# EAGLE design avr modem (EAGLE 6.4)
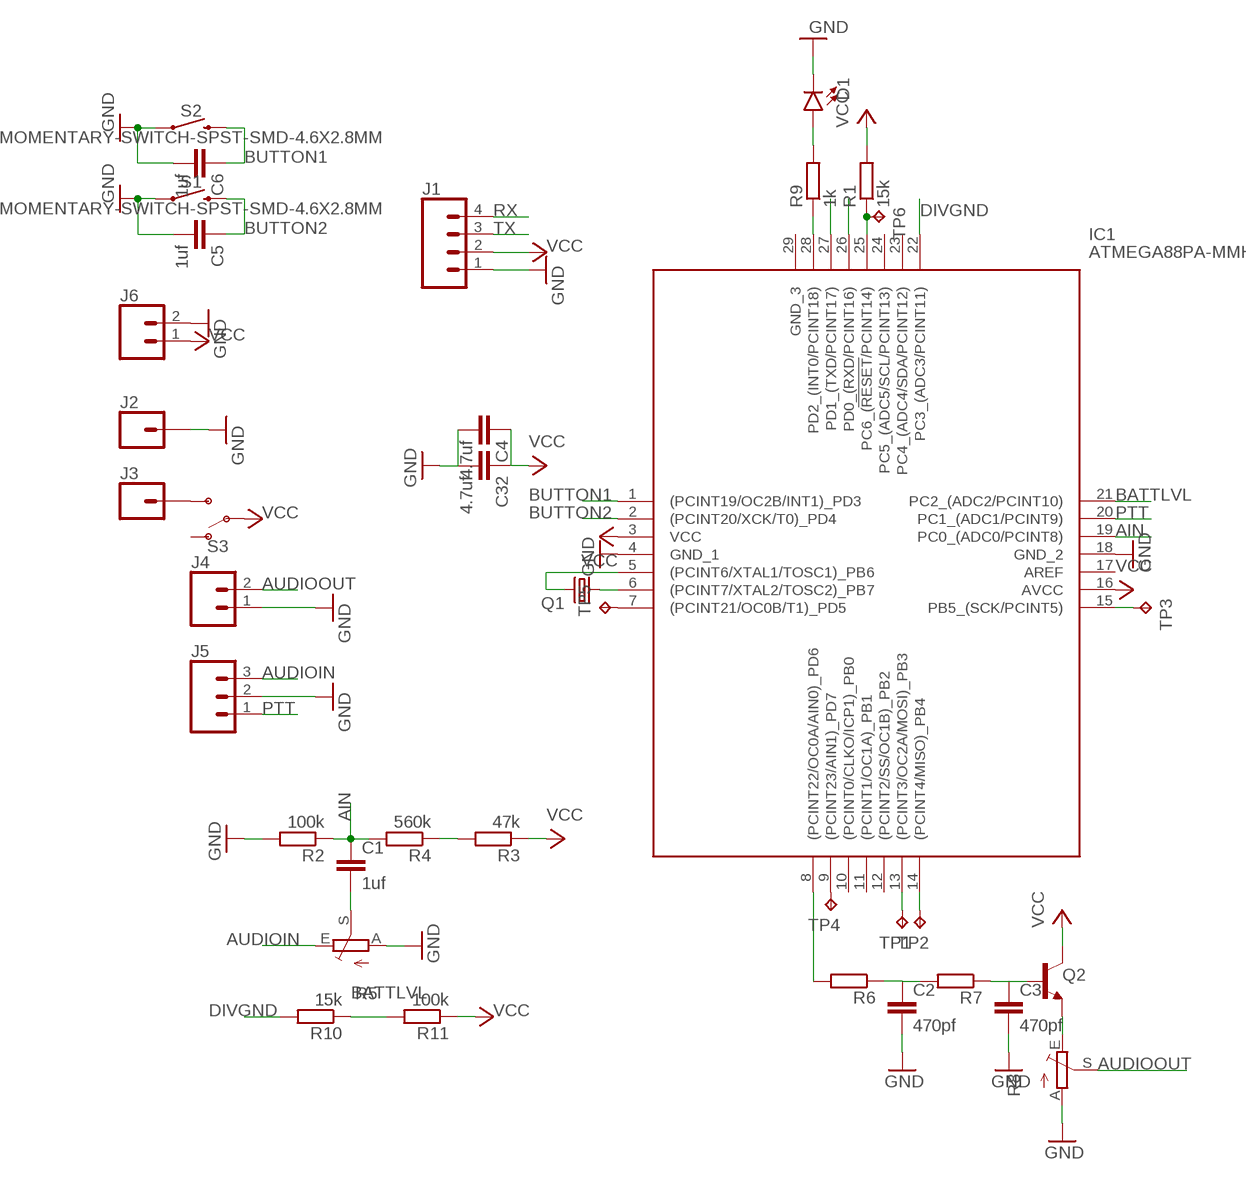
[diagram p0: schematic, sheet 1]

## Parts
C1  1uf  C-EUC0805  [C0805]
C2  470pf  C-EUC0805  [C0805]
C3  470pf  C-EUC0805  [C0805]
C4  4.7uf  C-EUC0805  [C0805]
C5  1uf  C-EUC0805  [C0805]
C6  1uf  C-EUC0805  [C0805]
C32  4.7uf  C-EUC0805  [C0805]
D1  LED0603  [LED-0603]
IC1  ATMEGA88PA-MMH  [QFN45P400X400X100-29N]
J1  CONN_04LONGPADS  [1X04_LONGPADS]
J2  CONN_01PTH_LONGPAD  [1X01_LONGPAD]
J3  CONN_01PTH_LONGPAD  [1X01_LONGPAD]
J4  CONN_02PTH3  [1X02_LONGPADS]
J5  CONN_03LONGPADS  [1X03_LONGPADS]
J6  CONN_02PTH3  [1X02_LONGPADS]
Q1  CRYSTALCTS406  [CTS406]
Q2  TRANS_NPN-MMBTA42  [SOT23-3]
R1  15k  R-EU_M0805  [M0805]
R2  100k  R-EU_M0805  [M0805]
R3  47k  R-EU_M0805  [M0805]
R4  560k  R-EU_M0805  [M0805]
R5  TRIM_EU-CA6V  [CA6V]
R6  R-EU_M0805  [M0805]
R7  R-EU_M0805  [M0805]
R8  TRIM_EU-CA6V  [CA6V]
R9  1k  R-EU_M0805  [M0805]
R10  15k  R-EU_M0805  [M0805]
R11  100k  R-EU_M0805  [M0805]
S1  MOMENTARY-SWITCH-SPST-SMD-4.6X2.8MM  [TACTILE_SWITCH_SMD_4.6X2.8MM]
S2  MOMENTARY-SWITCH-SPST-SMD-4.6X2.8MM  [TACTILE_SWITCH_SMD_4.6X2.8MM]
S3  SWITCH-SPDT-SMD-RIGHT-ANGLE  [SWITCH_SPST_SMD_A]
TP1  TPTP15R  [TP15R]
TP2  TPTP15R  [TP15R]
TP3  TPTP15R  [TP15R]
TP4  TPTP15R  [TP15R]
TP5  TPTP15R  [TP15R]
TP6  TPTP15R  [TP15R]

## Nets
AIN: C1.1 IC1.19(PC0_(ADC0/PCINT8)) R2.1 R4.2
AUDIOIN: J5.3 R5.E
AUDIOOUT: J4.2 R8.S
BATTLVL: IC1.21(PC2_(ADC2/PCINT10)) R10.1 R11.2
BUTTON1: C6.1 IC1.1((PCINT19/OC2B/INT1)_PD3) S2.3 S2.4
BUTTON2: C5.1 IC1.2((PCINT20/XCK/T0)_PD4) S1.3 S1.4
DIVGND: IC1.22(PC3_(ADC3/PCINT11)) R10.2
GND: C2.2 C3.2 C4.2 C5.2 C6.2 C32.2 D1.C IC1.4(GND_1) IC1.18(GND_2) J1.1 J2.1 J4.1 J5.2 J6.2 R2.2 R5.A R8.A S1.1 S1.2 S2.1 S2.2
N$1: IC1.6((PCINT7/XTAL2/TOSC2)_PB7) Q1.1
N$2: IC1.5((PCINT6/XTAL1/TOSC1)_PB6) Q1.3
N$3: IC1.25(PC6_(!RESET!/PCINT14)) R1.1 TP6.TP
N$4: IC1.14((PCINT4/MISO)_PB4) TP2.TP
N$5: IC1.15(PB5_(SCK/PCINT5)) TP3.TP
N$6: IC1.13((PCINT3/OC2A/MOSI)_PB3) TP1.TP
N$7: R3.2 R4.1
N$8: C1.2 R5.S
N$9: IC1.8((PCINT22/OC0A/AIN0)_PD6) R6.2
N$10: C2.1 R6.1 R7.2
N$11: C3.1 Q2.1(B) R7.1
N$12: IC1.28(PD2_(INT0/PCINT18)) R9.1
N$13: D1.A R9.2
N$14: J3.1 S3.3(S)
N$15: IC1.9((PCINT23/AIN1)_PD7) TP4.TP
N$16: IC1.7((PCINT21/OC0B/T1)_PD5) TP5.TP
N$17: Q2.2(E) R8.E
PTT: IC1.20(PC1_(ADC1/PCINT9)) J5.1
RX: IC1.26(PD0_(RXD/PCINT16)) J1.4
TX: IC1.27(PD1_(TXD/PCINT17)) J1.3
VCC: C4.1 C32.1 IC1.3(VCC) IC1.16(AVCC) J1.2 J6.1 Q2.3(C) R1.2 R3.1 R11.1 S3.2(P)
Unconnected: IC1.10((PCINT0/CLKO/ICP1)_PB0) IC1.11((PCINT1/OC1A)_PB1) IC1.12((PCINT2/SS/OC1B)_PB2) IC1.17(AREF) IC1.23(PC4_(ADC4/SDA/PCINT12)) IC1.24(PC5_(ADC5/SCL/PCINT13)) IC1.29(GND_3) S3.1(O)

## Library data of the parts
C1-C6 C32 = resistor:C-EU: CAPACITOR, European symbol
D1 = SparkFun-LED:LED: LED (Generic) Standard schematic elements and footprints for 5mm, 3mm, 1206, and 0603 sized LEDs. Generic LEDs with no color specified.
IC1 = SamacSys_Parts:ATMEGA88PA-MMH: ATMEGA88PA-MMH, 8 bit AVR Microcontroller 20MHz 8kb Flash, 1kb RAM, I2C SPI 28-Pin VQFN Source: Datasheet <https://datasheet.datasheetarchive.com/originals/distributors/Datasheets_SAMA/81e6b951babeaaddc9de6b0e081ba8bf.pdf>; DESCRIPTION: ATMEGA88PA-MMH, 8 bit AVR Microcontroller 20MHz 8kb Flash, 1kb RAM, I2C SPI 28-Pin VQFN; HEIGHT: 1mm; MANUFACTURER_NAME: Microchip; MANUFACTURER_PART_NUMBER: ATMEGA88PA-MMH; MOUSER_PART_NUMBER: 556-ATMEGA88PA-MMH; MOUSER_PRICE-STOCK: https://www.mouser.co.uk/ProductDetail/Microchip-Technology-Atmel/ATMEGA88PA-MMH?qs=VXy%252BgAb0zZT2w9IbX66NBQ%3D%3D
J1 = SparkFun-Connectors:CONN_04: Multi connection point. Often used as Generic Header-pin footprint for 0.1 inch spaced/style header connections On any of the 0.1 inch spaced packages, you can populate with these: Break Away Headers - Straight <https://www.sparkfun.com/products/116> (PRT-00116) Break Away Male Headers - Right Angle <https://www.sparkfun.com/products/553> (PRT-00553) Female Headers <https://www.sparkfun.com/products/115> (PRT-00115) Break Away Headers - Machine Pin <https://www.sparkfun.com/products/117> (PRT-00117) Break Away Female Headers - Swiss Machine Pin <https://www.sparkfun.com/products/743> (PRT-00743) For SCREWTERMINALS and SPRING TERMINALS visit here: Screw Terimnals on SparkFun.com <https://www.sparkfun.com/search/results?term=Screw+Terminals> (5mm/3.5mm/2.54mm spacing) This device is also useful as a general connection point to wire up your design to another part of your project. Our various solder wires solder well into these plated through hole pads. Hook-Up Wire - Assortment (Stranded, 22 AWG) <https://www.sparkfun.com/products/11375> (PRT-11375) Hook-Up Wire - Assortment (Solid Core, 22 AWG) <https://www.sparkfun.com/products/11367> (PRT-11367) View the entire wire category on our website here <https://www.sparkfun.com/categories/141> Special notes: Molex polarized connector foot print use with SKU : PRT-08231 with associated crimp pins and housings. 1MM SMD Version SKU: PRT-10208; PROD_ID: CONN-09696
J2 J3 = SparkFun-Connectors:CONN_01: Single connection point. Often used as Generic Header-pin footprint for 0.1 inch spaced/style header connections On any of the 0.1 inch spaced packages, you can populate with these: Break Away Headers - Straight <https://www.sparkfun.com/products/116> (PRT-00116) Break Away Male Headers - Right Angle <https://www.sparkfun.com/products/553> (PRT-00553) Female Headers <https://www.sparkfun.com/products/115> (PRT-00115) Break Away Headers - Machine Pin <https://www.sparkfun.com/products/117> (PRT-00117) Break Away Female Headers - Swiss Machine Pin <https://www.sparkfun.com/products/743> (PRT-00743) This device is also useful as a general connection point to wire up your design to another part of your project. Our various solder wires solder well into these plated through hole pads. Hook-Up Wire - Assortment (Stranded, 22 AWG) <https://www.sparkfun.com/products/11375> (PRT-11375) Hook-Up Wire - Assortment (Solid Core, 22 AWG) <https://www.sparkfun.com/products/11367> (PRT-11367) View the entire wire category on our website here <https://www.sparkfun.com/categories/141> Special notes: SMTSO-256-ET is a "flush mount" nut for a 4-40 screw. We mostly use this on specialty testbeds; it is a nice way to connect hardware to your PCB at an adjustable hieght. Also note, the SNAP packages are for using a snappable style connector. We sell a baggie of snaps and they are also used on two LilyPad designs: Snap Assortment - 30 pack (male and female) <https://www.sparkfun.com/products/11347> (DEV-11347) LilyPad Arduino SimpleSnap <https://www.sparkfun.com/products/10941> (DEV-10941) LilyPad SimpleSnap Protoboard <https://www.sparkfun.com/products/10940> (DEV-10940)
J4 J6 = SparkFun-Connectors:CONN_02: Multi connection point. Often used as Generic Header-pin footprint for 0.1 inch spaced/style header connections On any of the 0.1 inch spaced packages, you can populate with these: Break Away Headers - Straight <https://www.sparkfun.com/products/116> (PRT-00116) Break Away Male Headers - Right Angle <https://www.sparkfun.com/products/553> (PRT-00553) Female Headers <https://www.sparkfun.com/products/115> (PRT-00115) Break Away Headers - Machine Pin <https://www.sparkfun.com/products/117> (PRT-00117) Break Away Female Headers - Swiss Machine Pin <https://www.sparkfun.com/products/743> (PRT-00743) For SCREWTERMINALS and SPRING TERMINALS visit here: Screw Terimnals on SparkFun.com <https://www.sparkfun.com/search/results?term=Screw+Terminals> (5mm/3.5mm/2.54mm spacing) This device is also useful as a general connection point to wire up your design to another part of your project. Our various solder wires solder well into these plated through hole pads. Hook-Up Wire - Assortment (Stranded, 22 AWG) <https://www.sparkfun.com/products/11375> (PRT-11375) Hook-Up Wire - Assortment (Solid Core, 22 AWG) <https://www.sparkfun.com/products/11367> (PRT-11367) View the entire wire category on our website here <https://www.sparkfun.com/categories/141> Special notes: Molex polarized connector foot print use with: PRT-08233 with associated crimp pins and housings. 2.54_SCREWTERM for use with PRT-10571. 3.5mm Screw Terminal footprints for PRT-08084 5mm Screw Terminal footprints for use with PRT-08432
J5 = SparkFun-Connectors:CONN_03: Multi connection point. Often used as Generic Header-pin footprint for 0.1 inch spaced/style header connections On any of the 0.1 inch spaced packages, you can populate with these: Break Away Headers - Straight <https://www.sparkfun.com/products/116> (PRT-00116) Break Away Male Headers - Right Angle <https://www.sparkfun.com/products/553> (PRT-00553) Female Headers <https://www.sparkfun.com/products/115> (PRT-00115) Break Away Headers - Machine Pin <https://www.sparkfun.com/products/117> (PRT-00117) Break Away Female Headers - Swiss Machine Pin <https://www.sparkfun.com/products/743> (PRT-00743) Stackable Header - 3 Pin (Female, 0.1") <https://www.sparkfun.com/products/13875> (PRT-13875) For SCREWTERMINALS and SPRING TERMINALS visit here: Screw Terimnals on SparkFun.com <https://www.sparkfun.com/search/results?term=Screw+Terminals> (5mm/3.5mm/2.54mm spacing) This device is also useful as a general connection point to wire up your design to another part of your project. Our various solder wires solder well into these plated through hole pads. Hook-Up Wire - Assortment (Stranded, 22 AWG) <https://www.sparkfun.com/products/11375> (PRT-11375) Hook-Up Wire - Assortment (Solid Core, 22 AWG) <https://www.sparkfun.com/products/11367> (PRT-11367) View the entire wire category on our website here <https://www.sparkfun.com/categories/141> Special notes: Molex polarized connector foot print use with SKU : PRT-08232 with associated crimp pins and housings.
Q1 = crystal:CRYSTAL: CRYSTAL; OC_FARNELL: unknown; OC_NEWARK: unknown
Q2 = SparkFun-DiscreteSemi:TRANS_NPN: NPN transistor Current controlled devices typically used to amplify current or used as a switch. BC547 - COM-08928 <http://www.sparkfun.com/products/8928> (TO-92 45V 100mA) (1.Collector 2.Base 3.Emitter) 2N3904 - COM-00521 <http://www.sparkfun.com/products/521> (TO-92 40V 200mA) (1.Emitter 2.Base 3.Collector) P2N2222A - COM-12852 <http://www.sparkfun.com/products/12852> (TO-92 40V 600mA) (1.Collector 2.Base 3.Emitter); PROD_ID: TRANS-09116; VALUE: 500mA/300V
R1-R4 R6 R7 R9-R11 = rcl:R-EU_: RESISTOR, European symbol
R5 R8 = pot:TRIM_EU-: POTENTIOMETER
S1 S2 = SparkFun-Switches:MOMENTARY-SWITCH-SPST: Momentary Switch (Pushbutton) - SPST Normally-open (NO) SPST momentary switches (buttons, pushbuttons). Variants PTH-12MM - 12mm square, through-hole Momentary Pushbutton Switch - 12mm Square <https://www.sparkfun.com/products/9190> (COM-09190) PTH-6.0MM, PTH-6.0MM-KIT - 6.0mm square, through-hole Mini Pushbutton Switch <https://www.sparkfun.com/products/97> (COM-00097) KIT package intended for soldering kit's - only one side of pads' copper is exposed. PTH-RIGHT-ANGLE-KIT - Right-angle, through-hole Right Angle Tactile Button <https://www.sparkfun.com/products/10791> - Used on SparkFun BigTime Watch Kit <https://www.sparkfun.com/products/11734> SMD-12MM - 12mm square, surface-mount Tactile Button - SMD (12mm) <https://www.sparkfun.com/products/12993> (COM-12993) Used on SparkFun PicoBoard <https://www.sparkfun.com/products/11888> SMD-4.5MM - 4.5mm Square Trackball Switch Used on SparkFun Blackberry Trackballer Breakout <https://www.sparkfun.com/products/13169> SMD-4.6MMX2.8MM - 4.60mm x 2.80mm, surface mount Used on SparkFun SAMD21 Mini Breakout <https://www.sparkfun.com/products/13664> SMD-5.2MM, SMD-5.2-REDUNDANT - 5.2mm square, surface-mount Mini Pushbutton Switch - SMD <https://www.sparkfun.com/products/8720> (COM-08720) Used on Arduino Pro Mini <https://www.sparkfun.com/products/11114> REDUNDANT package connects both switch circuits together SMD-6.0X3.5MM - 6.0 x 3.5mm, surface mount Momentary Reset Switch SMD <https://www.sparkfun.com/products/8229> (COM-08229) SMD-6.2MM-TALL - 6.2mm square, surface mount Tactile Button - SMD (6mm) <https://www.sparkfun.com/products/12992> Used on SparkFun Digital Sandbox <https://www.sparkfun.com/products/12651> SMD-RIGHT-ANGLE - Right-angle, surface mount Used on SparkFun Block for Intel® Edison - Arduino <https://www.sparkfun.com/products/13036>; PROD_ID: SWCH-13065
S3 = SparkFun-Switches:SWITCH-SPDT: Single Pole, Double Throw (SPDT) Switch Single-pole, double-throw (SPDT) switch. Variant Overview SMD-AYZ0202 Surface Mount DPDT Switch <https://www.sparkfun.com/products/597> (COM-00597) Used on e.g. LilyPad Arduino USB - ATmega32U4 Board <https://www.sparkfun.com/products/12049> PTH-11.6X4.0MM SPDT Mini Power Switch <https://www.sparkfun.com/products/102> (COM-00102) Used on e.g. SparkFun Simon Says - Through-Hole Soldering Kit <https://www.sparkfun.com/products/10547> (KIT-10547) PTH-11.6X4.0MM-KIT KIT version of SPDT Mini Power Switch - Simplifies soldering by removing tStop of switch pins - only one side can be soldered. PTH-11.6X4.0MM-LOCK LOCK version of SPDT Mini Power Switch - Offset pins hold switch in place for easier soldering. SMD-RIGHT-ANGLE Surface Mount Right Angle Switch <https://www.sparkfun.com/products/10860> (COM-10860) Used on e.g. SparkFun ESP8266 Thing <https://www.sparkfun.com/products/13231>; PROD_ID: SWCH-10651; SF_SKU: COM-10860
TP1-TP6 = testpad:TP: Test pad

## Board
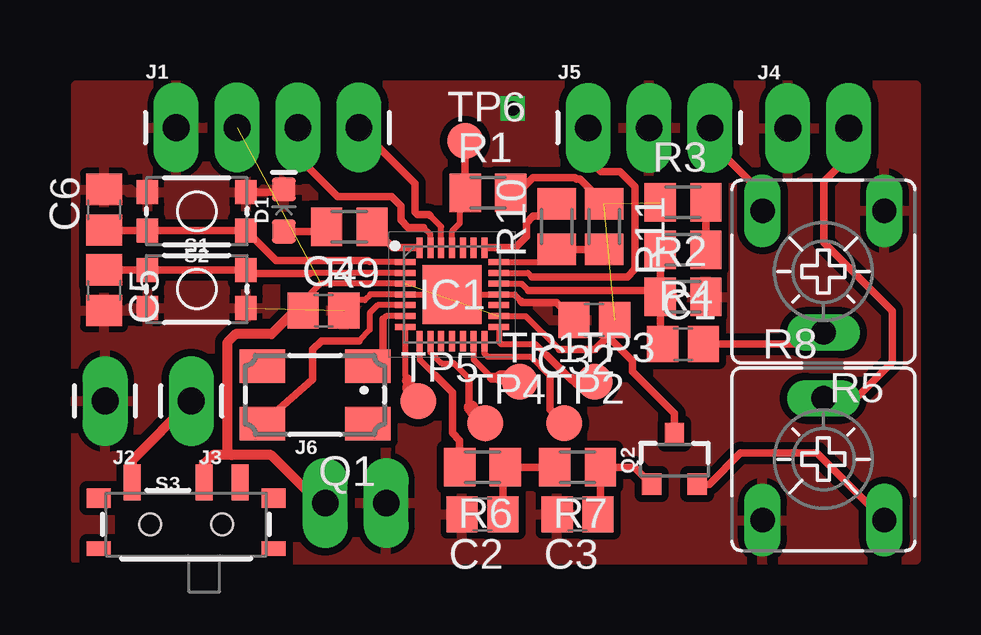
[diagram p1: board, top side]
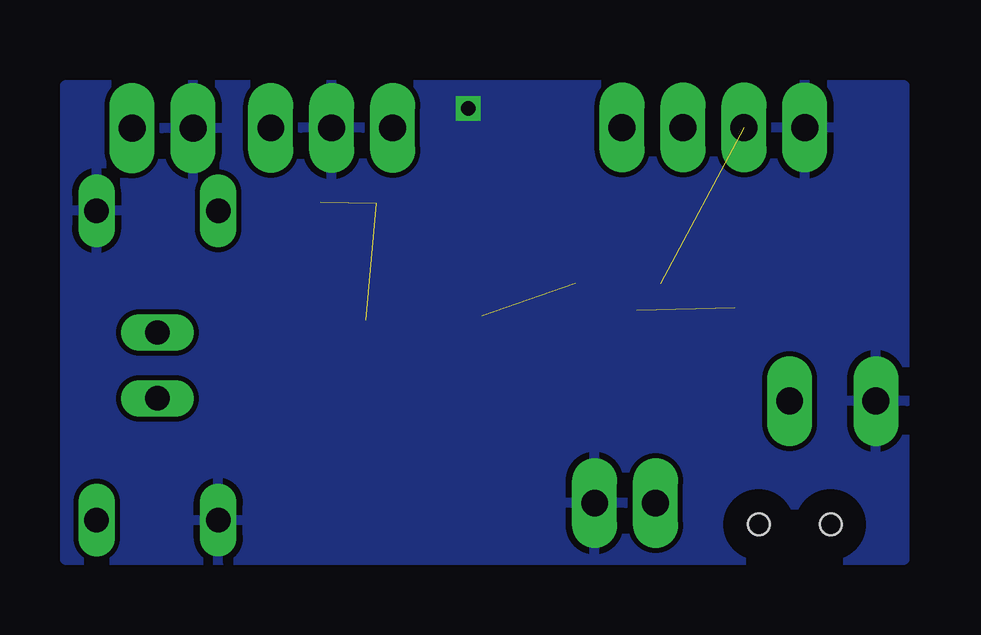
[diagram p2: board, bottom side, seen from below]

No outline drawn. Coordinates in mm, seen from the top.
Copper layers (1*16): Top 0.035mm / dielectric 1.5mm / Bottom 0.035mm
Design rules "default": minimum track width 10mil, minimum drill 24mil, track to track 8mil, track to pad 8mil, pad to pad 8mil, via to via 8mil, smd to smd 8mil, copper to edge 40mil, drill to drill 8mil, minimum pad ring 10mil, minimum via ring 8mil, stop-mask expansion 4mil, vias tented up to drill 0mil, thermal gap 10mil

### Footprints (pad centres in the part's own frame; a part is rotated, then mirrored left to right if it is on the bottom)
C0805 = smd 1.3 x 1.5: 1 -0.85,0; 2 0.85,0
LED-0603 = smd 1 x 1: A -0.877,0; C 0.877,0
QFN45P400X400X100-29N = smd 0.85 x 0.25: 1 -1.95,1.35; 2 -1.95,0.9; 3 -1.95,0.45; 4 -1.95,0; 5 -1.95,-0.45; 6 -1.95,-0.9; 7 -1.95,-1.35; 15 1.95,-1.35; 16 1.95,-0.9; 17 1.95,-0.45; 18 1.95,0; 19 1.95,0.45; 20 1.95,0.9; 21 1.95,1.35 | smd 0.25 x 0.85: 8 -1.35,-1.95; 9 -0.9,-1.95; 10 -0.45,-1.95; 11 0,-1.95; 12 0.45,-1.95; 13 0.9,-1.95; 14 1.35,-1.95; 22 1.35,1.95; 23 0.9,1.95; 24 0.45,1.95; 25 0,1.95; 26 -0.45,1.95; 27 -0.9,1.95; 28 -1.35,1.95 | smd 2.45 x 2.45: 29 0,0
1X04_LONGPADS = drill 1.118 pad 1.88 long: 1 0,0; 2 2.54,0; 3 5.08,0; 4 7.62,0
1X01_LONGPAD = drill 1.118 pad 1.88 long: 1 0,0
1X02_LONGPADS = drill 1.118 pad 1.88 long: 1 0,0; 2 2.54,0
1X03_LONGPADS = drill 1.118 pad 1.88 long: 1 0,0; 2 2.54,0; 3 5.08,0
CTS406 = smd 1.9 x 1.4: 1 -2.2,-1.2; 2 2.2,-1.2; 3 2.2,1.2; 4 -2.2,1.2
SOT23-3 = smd 0.8 x 0.9: 1 -0.95,-1; 2 0.95,-1; 3 0,1.1
M0805 = smd 1.3 x 1.6: 1 -0.95,0; 2 0.95,0
CA6V = drill 1.016 long: A -2.54,-2.54; E 2.54,-2.54; S 0,2.54
TACTILE_SWITCH_SMD_4.6X2.8MM = smd 0.9 x 1: 1 -2.05,-0.8; 2 2.05,-0.8; 3 2.05,0.8; 4 -2.05,0.8
SWITCH_SPST_SMD_A = smd 0.7 x 1.5: 1 -2.25,-1.75; 2 -0.75,-1.75; 3 2.25,-1.75 | smd 1 x 0.6: GND1 -3.65,1; GND3 3.65,1 | smd 1 x 0.8: GND2 -3.65,-1.1; GND4 3.65,-1.1 | hole 0.9: -1.5,0; 1.5,0
TP15R = smd 1.5 x 1.5: TP 0,0

### Placement (x,y rotation side)
C1  125.2,44.92 0 top
C2  116.84,37.82 180 top
C3  120.8,37.82 180 top
C4  110.21,46.32 0 top
C5  101.07,47.17 270 top
C6  101.07,50.52 90 top
C32  121.5,45.92 180 top
D1  108.56,50.5 90 top
IC1  115.57,46.99 0 top
J1  104.06,53.95 0 top
J2  101.1,42.55 180 top
J3  104.7,42.55 180 top
J4  129.57,53.92 0 top
J5  121.25,53.94 0 top
J6  110.29,38.29 0 top
Q1  109.86,42.8 180 top
Q2  124.84,40.08 0 top
R1  117.07,51.22 0 top
R2  125.2,46.89 0 top
R3  125.2,50.83 0 top
R4  125.2,48.86 180 top
R5  131.05,47.94 180 top
R6  116.84,39.79 180 top
R7  120.8,39.79 180 top
R8  131.05,40.12 0 top
R9  111.29,49.81 180 top
R10  119.93,49.82 90 top
R11  121.91,49.82 270 top
S1  104.93,47.22 0 top
S2  104.93,50.46 180 top
S3  104.48,37.4 180 top
TP1  118.39,43.35 0 top
TP2  120.24,41.62 0 top
TP3  121.53,43.36 0 top
TP4  116.95,41.62 0 top
TP5  114.16,42.53 0 top
TP6  116.12,53.39 0 top

### Tracks (layer width: path | path; a pad name or v marks a point on that pad's centre or on a via)
AIN
  Top 0.254: IC1.19 118.47,47.44 118.76,47.16
  Top 0.305: 118.76,47.16 124.59,47.16 124.9,46.84 124.3,46.84 R2.1 | R4.2 R2.1 | R2.1 124.25,45.02 C1.1
AUDIOIN
  Top 0.305: R5.E 128.51,51.21 126.72,53 126.72,53.54 J5.3
AUDIOOUT
  Top 0.305: J4.2 132.1,52.73 131.06,51.69 131.06,49.16 133.92,46.3 133.92,44.17 132.42,42.67 131.06,42.67 R8.S
BATTLVL
  Top 0.254: IC1.21 119.39,48.34 R10.1
  Top 0.305: R10.1 R11.2
BUTTON1
  Top 0.254: IC1.1 112.14,48.34 112.08,48.4
  Top 0.305: 112.08,48.4 108.23,48.4 S2.4 S2.3 101.08,49.66 C6.1
BUTTON2
  Top 0.254: IC1.2 109.73,47.89 109.64,47.87
  Top 0.305: 109.64,47.87 107.22,47.87 S1.3 S1.4 C5.1
DIVGND
  Top 0.305: IC1.22 118.21,48.94 118.67,49.4 118.67,49.97 118.95,50.25 119.15,50.25 119.41,50.51 119.66,50.51 R10.2
GND  (via drill 0.6)  (1 unrouted)
  Top 0.254: C4.2 111.49,46.75 111.92,46.75 112.17,46.99 IC1.4 IC1.18 118.17,46.99 118.45,46.71
  Top 0.305: S2.1 108.44,51.26 D1.C | 118.45,46.71 118.45,46.7 118.49,46.66 119.91,46.66 C32.2
  other vias: 118.1,54.75
  pour Top (isolate 0.305): 99.9,55.71 134.91,55.71 134.91,35.93 99.9,35.93
  pour Bottom: 99.9,55.71 134.91,55.71 134.91,35.93 99.9,35.93
N$1
  Top 0.254: IC1.6 112.82,46.09 112.69,45.96
  Top 0.305: 112.69,45.96 112.69,44.36 Q1.1
N$2
  Top 0.254: IC1.5 112.47,46.54 112.14,46.22 112.14,45.52 111.68,45.06
  Top 0.305: 111.68,45.06 110.13,45.06 109.77,44.69 109.77,43.44 Q1.3
N$3
  Top 0.254: IC1.25 115.57,49.63 115.9,49.96 115.9,50.59 R1.1
  Top 0.305: R1.1 TP6.TP
N$4
  Top 0.254: IC1.14 116.92,44.53 117.06,44.4 118.86,44.4 119.66,43.6
  Top 0.305: 119.66,43.6 119.66,42.2 TP2.TP
N$5
  Top 0.254: IC1.15 117.52,45.02 117.61,44.92 119.05,44.92 119.53,44.44
  Top 0.305: 119.53,44.44 120.48,43.48 120.56,43.48
  Top 0.406: 120.56,43.48 120.61,43.43 120.84,43.37
  Top 0.61: 120.84,43.37 120.92,43.29 TP3.TP
N$6
  Top 0.254: IC1.13 116.47,44.27 117.22,43.52
  Top 0.406: 117.22,43.52 117.61,43.52
  Top 0.61: 117.61,43.52 118.21,43.52 TP1.TP
N$7
  Top 0.305: R3.2 R4.1
N$8
  Top 0.305: C1.2 130.57,44.92 R5.S
N$9
  Top 0.254: IC1.8 114.22,44.28 114.88,43.61
  Top 0.305: 114.88,43.61 115.58,42.91 115.58,41.21 115.89,40.9 R6.2
N$10
  Top 0.305: R7.2 R6.1 117.69,39.69 C2.1
N$11
  Top 0.305: C3.1 121.75,37.92 R7.1 123.18,39.79 Q2.1
N$12
  Top 0.305: IC1.28 113.11,48.94 R9.1
N$13
  Top 0.305: D1.A 110.15,49.62 R9.2
N$14
  Top 0.406: S3.3 102.23,40.08 J3.1
N$15
  Top 0.254: IC1.9 114.67,44.59 115.14,44.12 115.65,44.12 116.27,43.5
  Top 0.305: 116.27,43.5 116.27,42.38 116.36,42.28
  Top 0.61: 116.36,42.28 116.5,42.06 TP4.TP
N$16
  Top 0.254: IC1.7 113.62,43.63 113.72,43.33
  Top 0.406: 113.72,43.33 113.7,43.45 113.79,43.1
  Top 0.61: 113.79,43.1 113.83,42.86 TP5.TP
N$17
  Top 0.305: Q2.2 126.29,39.08 127.6,40.39 130.78,40.39 R8.E
PTT
  Top 0.254: IC1.20 118.73,47.89 118.91,47.71
  Top 0.305: 118.91,47.71 122.87,47.71 123.2,48.04 123.2,51.49 122.57,52.12 121.78,52.12 121.47,52.43 121.47,53.71 J5.1
RX
  Top 0.254: IC1.26 115.12,49.81 114.66,50.28
  Top 0.305: 114.66,50.28 114.62,50.32 114.12,50.32 114.02,50.42 114.02,51.61 J1.4
TX
  Top 0.254: IC1.27 114.67,49.5 114.39,49.78
  Top 0.305: 114.39,49.78 113.74,49.78 113.44,50.09 113.44,50.67 113.04,51.07 110.8,51.07 109.42,52.44 109.42,53.67 J1.3
VCC  (4 unrouted)
  Top 0.254: IC1.3 110.09,47.44 109.69,47.04 109.69,46.65 C4.1 | IC1.16 118.64,46.09 120.04,44.69
  Top 0.305: 120.04,44.69 121.53,44.69 122.07,45.24 | 122.07,45.24 122.21,45.38 122.21,45.78 C32.1 | Q2.3 124.84,42.02 123.09,43.78 123.09,44.22 122.07,45.24 | R1.2 118.3,51.22 118.94,51.85 120.7,51.85 120.76,51.79 120.9,51.79 121.37,51.32 121.37,51.31 R11.1
  Top 0.406: J6.1 110.03,38.29 108.03,40.3 106.39,40.3 | 106.39,40.3 105.6,40.3 105.23,39.93 S3.2 | C4.1 109.02,46.32 108.04,45.34 106.55,45.34 106.2,44.98 106.2,40.49 106.39,40.3